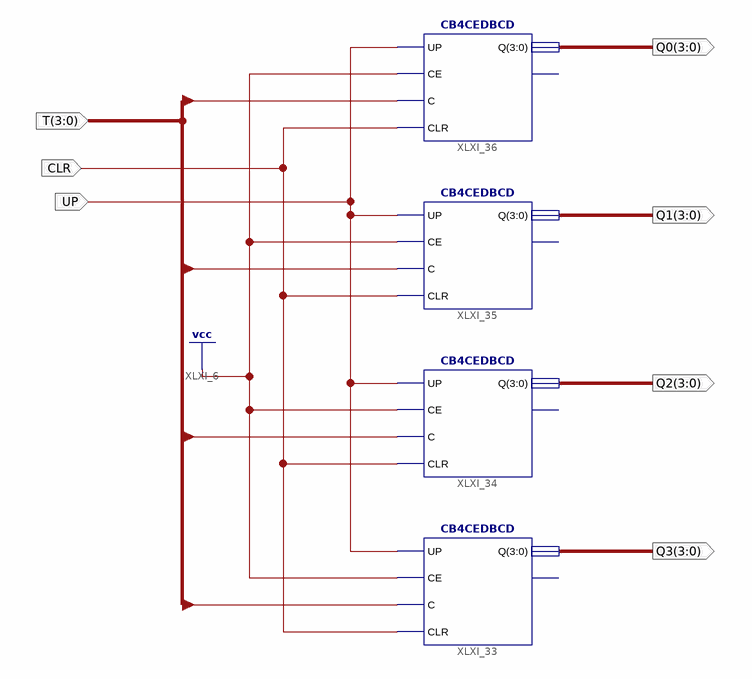
[diagram p0: schematic sheet 1]
// Xilinx ISE schematic AlterableBCD.sch (spartan3e) as structural Verilog: 4 symbols, 7 ports
module AlterableBCD (
  input  [3:0] T,
  input  UP,
  input  CLR,
  output [3:0] Q0,
  output [3:0] Q1,
  output [3:0] Q2,
  output [3:0] Q3
);

  CB4CEDBCD XLXI_33 (.C(T[3]), .CE(1'b1), .CLR(CLR), .Q(Q3), .UP(UP));  // open: CEO
  CB4CEDBCD XLXI_34 (.C(T[2]), .CE(1'b1), .CLR(CLR), .Q(Q2), .UP(UP));  // open: CEO
  CB4CEDBCD XLXI_35 (.C(T[1]), .CE(1'b1), .CLR(CLR), .Q(Q1), .UP(UP));  // open: CEO
  CB4CEDBCD XLXI_36 (.C(T[0]), .CE(1'b1), .CLR(CLR), .Q(Q0), .UP(UP));  // open: CEO
endmodule
